# Altium schematic sheet AUDIO&ETHNET.SchDoc
size A4
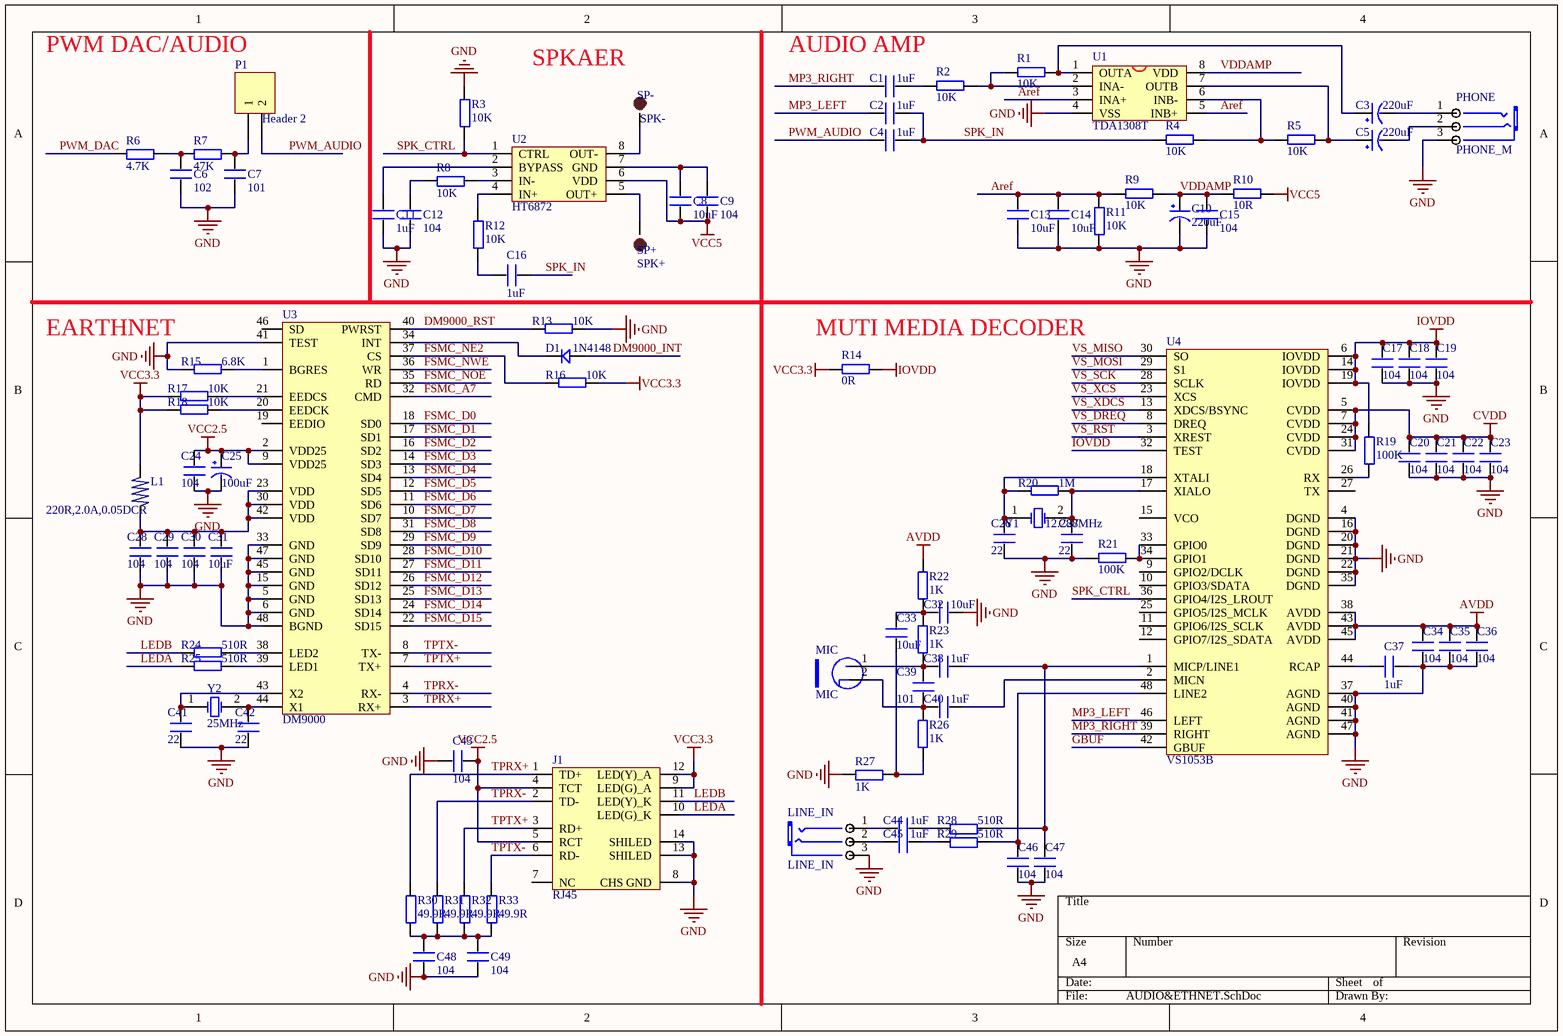
[diagram p0: AUDIO&ETHNET.SchDoc]

## Parts
C1  1uF  [0603P]
C2  1uF  [0603P]
C3  220uF  [CC6.56.5]
C4  1uF  [0603P]
C5  220uF  [CC6.56.5]
C6  102  [0603P]
C7  101  [0603P]
C8  10uF  [0603P]
C9  104  [0603P]
C10  220uF  [CC6.56.5]
C11  1uF  [0603P]
C12  104  [0603P]
C13  10uF  [0603P]
C14  10uF  [0603P]
C15  104  [0603P]
C16  1uF  [0603P]
C17  104  [0603P]
C18  104  [0603P]
C19  104  [0603P]
C20  104  [0603P]
C21  104  [0603P]
C22  104  [0603P]
C23  104  [0603P]
C24  104  [0603P]
C25  100uF  [CC6.56.5]
C26  22  [0603P]
C27  22  [0603P]
C28  104  [0603P]
C29  104  [0603P]
C30  104  [0603P]
C31  10uF  [0603P]
C32  10uF  [0603P]
C33  10uF  [0603P]
C34  104  [0603P]
C35  104  [0603P]
C36  104  [0603P]
C37  1uF  [0603P]
C38  1uF  [0603P]
C39  101  [0603P]
C40  1uF  [0603P]
C41  22  [0603P]
C42  22  [0603P]
C43  104  [0603P]
C44  1uF  [0603P]
C45  1uF  [0603P]
C46  104  [0603P]
C47  104  [0603P]
C48  104  [0603P]
C49  104  [0603P]
D1  1N4148  [DIODE_SOP]
J1  RJ45  [HR911105A]
L1  220R,2.0A,0.05DCR  [0603P]
LINE_IN  LINE_IN  [PHONE_ST]
MIC  MIC  [MIC-6022]
P1  Header 2  [HDR1X2]
PHONE  PHONE_M  [PHONE_ST]
R1  10K  [0603P]
R2  10K  [0603P]
R3  10K  [0603P]
R4  10K  [0603P]
R5  10K  [0603P]
R6  4.7K  [0603P]
R7  47K  [0603P]
R8  10K  [0603P]
R9  10K  [0603P]
R10  10R  [0603P]
R11  10K  [0603P]
R12  10K  [0603P]
R13  10K  [0603P]
R14  0R  [0603P]
R15  6.8K  [0603P]
R16  10K  [0603P]
R17  10K  [0603P]
R18  10K  [0603P]
R19  100K  [0603P]
R20  1M  [0603P]
R21  100K  [0603P]
R22  1K  [0603P]
R23  1K  [0603P]
R24  510R  [0603P]
R25  510R  [0603P]
R26  1K  [0603P]
R27  1K  [0603P]
R28  510R  [0603P]
R29  510R  [0603P]
R30  49.9R  [0603P]
R31  49.9R  [0603P]
R32  49.9R  [0603P]
R33  49.9R  [0603P]
SP+  SPK+  [TP-1.5]
SP-  SPK-  [TP-1.5]
U1  TDA1308T  [SOP-8]
U2  HT6872  [SOP-8]
U3  DM9000  [mTQFP48]
U4  VS1053B  [mTQFP48]
Y1  12.288MHz  [XTAL_US]
Y2  25MHz  [XTAL_US]

## Nets
AVDD: C34.1 C35.1 C36.1 R22.1 U4.38(AVDD) U4.43(AVDD) U4.45(AVDD)
CVDD: C20.1 C21.1 C22.1 C23.1 U4.5(CVDD) U4.7(CVDD) U4.24(CVDD) U4.31(CVDD)
GND: C6.1 C7.1 C10.2(GND) C11.1 C12.1 C13.1 C14.1 C15.1 C17.2 C18.2 C19.2 C20.2 C21.2 C22.2 C23.2 C24.1 C25.2(GND) C26.1 C27.1 C28.1 C29.1 C30.1 C31.1 C32.2 C34.2 C35.2 C36.2 C37.2 C41.1 C42.1 C43.2 C46.2 C47.2 C48.2 C49.2 J1.8(CHS_GND) J1.13(SHILED) J1.14(SHILED) LINE_IN.3(COM) PHONE.3(COM) R3.2 R11.1 R13.1 R15.2 R21.2 R27.1 U1.4(VSS) U3.5(GND) U3.6(GND) U3.15(GND) U3.33(GND) U3.41(TEST) U3.45(GND) U3.47(GND) U3.48(BGND) U4.4(DGND) U4.16(DGND) U4.20(DGND) U4.21(DGND) U4.22(DGND) U4.35(DGND) U4.37(AGND) U4.40(AGND) U4.41(AGND) U4.47(AGND)
IOVDD: C17.1 C18.1 C19.1 R14.1 R19.2 U4.6(IOVDD) U4.14(IOVDD) U4.19(IOVDD) U4.32(TEST)
VCC2.5: C24.2 C25.1(VCC) C43.1 J1.4(TCT) J1.5(RCT) U3.2(VDD25) U3.9(VDD25)
VCC3.3: J1.9(LED(G)_A) J1.12(LED(Y)_A) L1.2 R14.2 R16.1 R17.2 R18.2
VCC5: C8.1 C9.1 R10.1 U2.6(VDD)
Aref: C13.2 C14.2 R9.2 R11.2 U1.3(INA+) U1.5(INB+)
DM9000_INT: D1.1
DM9000_RST: R13.2 U3.40(PWRST)
FSMC_A7: U3.32(CMD)
FSMC_D0: U3.18(SD0)
FSMC_D1: U3.17(SD1)
FSMC_D2: U3.16(SD2)
FSMC_D3: U3.14(SD3)
FSMC_D4: U3.13(SD4)
FSMC_D5: U3.12(SD5)
FSMC_D6: U3.11(SD6)
FSMC_D7: U3.10(SD7)
FSMC_D8: U3.31(SD8)
FSMC_D9: U3.29(SD9)
FSMC_D10: U3.28(SD10)
FSMC_D11: U3.27(SD11)
FSMC_D12: U3.26(SD12)
FSMC_D13: U3.25(SD13)
FSMC_D14: U3.24(SD14)
FSMC_D15: U3.22(SD15)
FSMC_NE2: R16.2 U3.37(CS)
FSMC_NOE: U3.35(RD)
FSMC_NWE: U3.36(WR)
GBUF: U4.42(GBUF)
LEDA: J1.10(LED(G)_K) R25.2
LEDB: J1.11(LED(Y)_K) R24.2
MP3_LEFT: C2.2 U4.46(LEFT)
MP3_RIGHT: C1.2 U4.39(RIGHT)
PWM_AUDIO: C4.2 P1.2
PWM_DAC: R6.1
SPK_CTRL: R3.1 U2.1(CTRL) U4.36(GPIO4/I2S_LROUT)
SPK_IN: C2.1 C4.1 C16.1 R4.2
TPRX+: J1.1(TD+) R30.2 U3.3(RX+)
TPRX-: J1.2(TD-) R31.2 U3.4(RX-)
TPTX+: J1.3(RD+) R32.2 U3.7(TX+)
TPTX-: J1.6(RD-) R33.2 U3.8(TX-)
VDDAMP: C10.1(VCC) C15.2 R9.1 R10.2 U1.8(VDD)
VS_DREQ: U4.8(DREQ)
VS_MISO: U4.30(SO)
VS_MOSI: U4.29(S1)
VS_RST: U4.3(XREST)
VS_SCK: U4.28(SCLK)
VS_XCS: U4.23(XCS)
VS_XDCS: U4.13(XDCS/BSYNC)
NetC1_1: C1.1 R2.2
NetC3_1: C3.1(VCC) R1.1 U1.1(OUTA)
NetC3_2: C3.2(GND) PHONE.1(CHL)
NetC5_1: C5.1(VCC) R5.1 U1.7(OUTB)
NetC5_2: C5.2(GND) PHONE.2(CHR)
NetC6_2: C6.2 R6.2 R7.1
NetC7_2: C7.2 P1.1 R7.2
NetC8_2: C8.2 C9.2 U2.7(GND)
NetC11_2: C11.2 U2.2(BYPASS)
NetC12_2: C12.2 R8.1
NetC16_2: C16.2 R12.1
NetC26_2: C26.2 R20.2 U4.18(XTALI) Y1.1(OSC1)
NetC27_2: C27.2 R20.1 U4.17(XIALO) Y1.2(OSC2)
NetC28_2: C28.2 C29.2 C30.2 C31.2 L1.1 U3.23(VDD) U3.30(VDD) U3.42(VDD)
NetC32_1: C32.1 C33.1 R22.2 R23.1
NetC33_2: C33.2 R26.2 R27.2
NetC37_1: C37.1 U4.44(RCAP)
NetC38_1: C38.1 C39.1 MIC.1(VCC) R23.2
NetC38_2: C38.2 C47.1 R28.2 U4.1(MICP/LINE1)
NetC39_2: C39.2 C40.1 MIC.2(GND) R26.1
NetC40_2: C40.2 U4.2(MICN)
NetC41_2: C41.2 U3.43(X2) Y2.1(OSC1)
NetC42_2: C42.2 U3.44(X1) Y2.2(OSC2)
NetC44_1: C44.1 LINE_IN.1(CHL)
NetC44_2: C44.2 R28.1
NetC45_1: C45.1 LINE_IN.2(CHR)
NetC45_2: C45.2 R29.1
NetC46_1: C46.1 R29.2 U4.48(LINE2)
NetC48_1: C48.1 C49.1 R30.1 R31.1 R32.1 R33.1
NetD1_2: D1.2 U3.34(INT)
NetR1_2: R1.2 R2.1 U1.2(INA-)
NetR4_1: R4.1 R5.2 U1.6(INB-)
NetR8_2: R8.2 U2.3(IN-)
NetR12_2: R12.2 U2.4(IN+)
NetR15_1: R15.1 U3.1(BGRES)
NetR17_1: R17.1 U3.21(EEDCS)
NetR18_1: R18.1 U3.20(EEDCK)
NetR19_1: R19.1 U4.26(RX)
NetR21_1: R21.1 U4.33(GPIO0) U4.34(GPIO1)
NetR24_1: R24.1 U3.38(LED2)
NetR25_1: R25.1 U3.39(LED1)
NetSP+_1: SP+.1 U2.5(OUT+)
NetSP-_1: SP-.1 U2.8(OUT-)

Not connected (* = marked no-connect by the designer): J1 7(NC); U3 19(EEDIO) 46(SD); U4 9(GPIO2/DCLK) 10(GPIO3/SDATA) 11(GPIO6/I2S_SCLK) 12(GPIO7/I2S_SDATA) 15(VCO) 25(GPIO5/I2S_MCLK) 27(TX)

## Notes on the sheet
- PWM DAC/AUDIO
- SPKAER
- (near C1) AUDIO AMP
- EARTHNET
- (near R14) MUTI MEDIA DECODER

## Library data of the parts
C1 C2 C4 C6-C9 C11-C24 C26-C49 = C
C3 C5 C10 C25 = CAP
D1 = D
J1 = HR911105
L1 = L
LINE_IN = PHONE_M
P1 = Header 2: Header, 2-Pin; LatestRevisionDate: 17-Jul-2002; LatestRevisionNote: Re-released for DXP Platform.; Publisher: Altium Limited
R1-R33 = R
SP+ SP- = TEST-POINT: 测试点
U1 = TDA1308
U2 = HT6871
U3 = DM9000A
U4 = VS1053
Y1 Y2 = XTAL: Crystal Oscillator; Published: 8-Jun-2000; LatestRevisionDate: 17-Jul-2002; LatestRevisionNote: Re-released for DXP Platform.; Publisher: Altium Limited